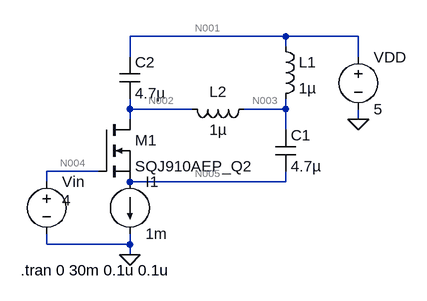
[diagram p0: schematic Draft5.asc]
Draft5.asc, the LTspice schematic file:
Version 4.1
SHEET 1 880 680
WIRE 464 0 224 0
WIRE 576 0 464 0
WIRE 464 16 464 0
WIRE 224 32 224 0
WIRE 576 32 576 0
WIRE 224 112 224 96
WIRE 320 112 224 112
WIRE 464 112 464 96
WIRE 464 112 400 112
WIRE 224 128 224 112
WIRE 576 128 576 112
WIRE 464 144 464 112
WIRE 176 208 96 208
WIRE 96 224 96 208
WIRE 464 224 464 208
WIRE 464 224 224 224
WIRE 96 320 96 304
WIRE 224 320 224 304
WIRE 224 320 96 320
WIRE 224 336 224 320
FLAG 224 336 0
FLAG 576 128 0
SYMBOL nmos 176 128 R0
SYMATTR InstName M1
SYMATTR Value SQJ910AEP_Q2
SYMBOL cap 448 144 R0
SYMATTR InstName C1
SYMATTR Value 4.7µ
SYMBOL voltage 96 208 R0
WINDOW 3 24 44 Left 2
WINDOW 123 0 0 Left 0
WINDOW 39 0 0 Left 0
SYMATTR InstName Vin
SYMATTR Value 4
SYMBOL current 224 224 R0
WINDOW 123 0 0 Left 0
WINDOW 39 0 0 Left 0
SYMATTR InstName I1
SYMATTR Value 1m
SYMBOL cap 208 32 R0
SYMATTR InstName C2
SYMATTR Value 4.7µ
SYMBOL ind 448 0 R0
SYMATTR InstName L1
SYMATTR Value 1µ
SYMBOL ind 416 96 R90
WINDOW 0 5 56 VBottom 2
WINDOW 3 32 56 VTop 2
SYMATTR InstName L2
SYMATTR Value 1µ
SYMBOL voltage 576 16 R0
WINDOW 123 0 0 Left 0
WINDOW 39 0 0 Left 0
SYMATTR InstName VDD
SYMATTR Value 5
TEXT 56 360 Left 2 !.tran 0 30m 0.1u 0.1u

The netlist it stands for:
* Draft5.asc
M1 N002 N004 N005 N005 SQJ910AEP_Q2
C1 N003 N005 4.7µ
Vin N004 0 4
I1 N005 0 1m
C2 N001 N002 4.7µ
L1 N001 N003 1µ
L2 N003 N002 1µ
VDD N001 0 5
.model NMOS NMOS
.model PMOS PMOS
.lib standard.mos
.tran 0 30m 0.1u 0.1u
.backanno
.end

* Results of the author's LTspice run, read from the files saved beside the schematic
* Operating Point, zero values left out:
*   V(n004) = 4 V
*   V(n003) = 5 V
*   V(n001) = 5 V
*   V(n002) = 5 V
*   V(n005) = 1.994 V
*   Id(M1) = 1 mA
*   Is(M1) = -1 mA
*   I(VDD) = -1 mA
*   I(L1) = 1 mA
*   I(I1) = 1 mA
*   I(L2) = 1 mA